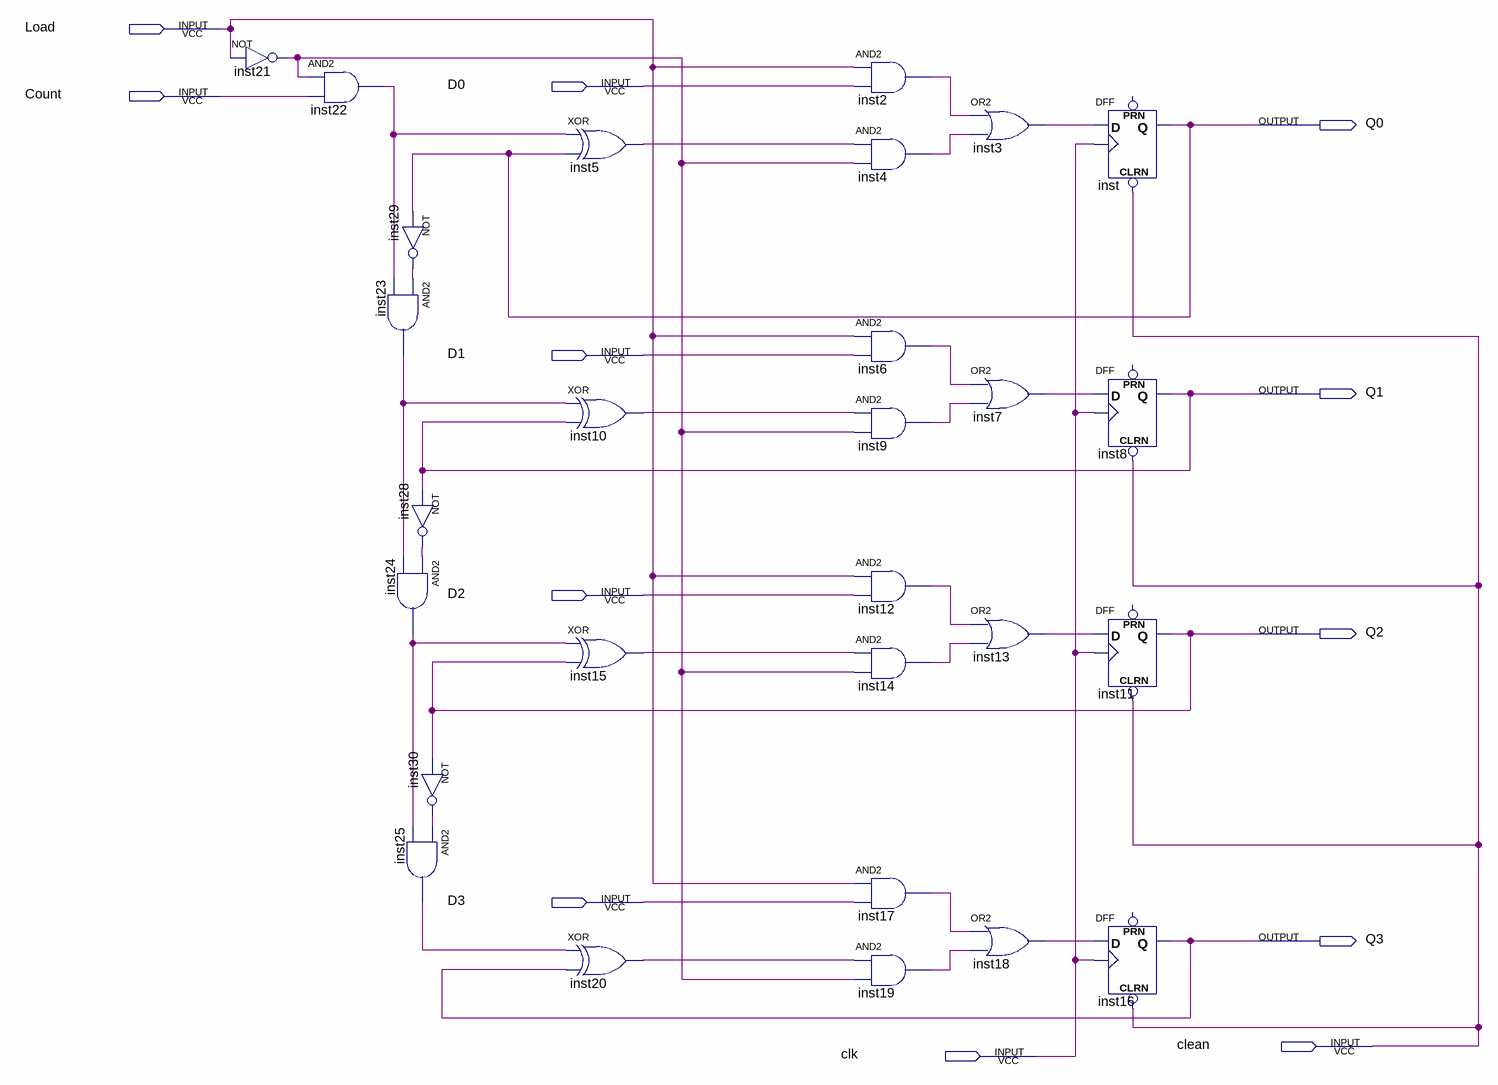
[diagram p0: schematic sheet]
// Quartus schematic counter.bdf as structural Verilog: 28 symbols, 12 pins
module counter (
  input  Load,
  input  D0,
  input  Count,
  input  D1,
  input  D2,
  input  D3,
  input  clean,
  input  clk,
  output Q0,
  output Q1,
  output Q2,
  output Q3
);

  wire inst2_out, inst3_out, inst4_out, inst5_out, inst6_out, inst7_out, inst9_out, inst10_out, inst12_out,
       inst13_out, inst14_out, inst15_out, inst17_out, inst18_out, inst19_out, inst20_out, inst21_out,
       inst22_out, inst23_out, inst24_out, inst25_out, inst28_out, inst29_out, inst30_out;

  not inst21 (inst21_out, Load);
  and inst22 (inst22_out, inst21_out, Count);
  not inst29 (inst29_out, Q0);
  and inst23 (inst23_out, inst29_out, inst22_out);
  not inst28 (inst28_out, Q1);
  and inst24 (inst24_out, inst28_out, inst23_out);
  not inst30 (inst30_out, Q2);
  and inst25 (inst25_out, inst30_out, inst24_out);
  xor inst5 (inst5_out, inst22_out, Q0);
  xor inst10 (inst10_out, inst23_out, Q1);
  xor inst15 (inst15_out, inst24_out, Q2);
  xor inst20 (inst20_out, inst25_out, Q3);
  and inst2 (inst2_out, Load, D0);
  and inst4 (inst4_out, inst5_out, inst21_out);
  and inst6 (inst6_out, Load, D1);
  and inst9 (inst9_out, inst10_out, inst21_out);
  and inst12 (inst12_out, Load, D2);
  and inst14 (inst14_out, inst15_out, inst21_out);
  and inst17 (inst17_out, Load, D3);
  and inst19 (inst19_out, inst20_out, inst21_out);
  or inst3 (inst3_out, inst2_out, inst4_out);
  or inst7 (inst7_out, inst6_out, inst9_out);
  or inst13 (inst13_out, inst12_out, inst14_out);
  or inst18 (inst18_out, inst17_out, inst19_out);
  DFF inst (.CLRN(clean), .CLK(clk), .D(inst3_out), .Q(Q0));  // open: PRN
  DFF inst8 (.CLRN(clean), .CLK(clk), .D(inst7_out), .Q(Q1));  // open: PRN
  DFF inst11 (.CLRN(clean), .CLK(clk), .D(inst13_out), .Q(Q2));  // open: PRN
  DFF inst16 (.CLRN(clean), .CLK(clk), .D(inst18_out), .Q(Q3));  // open: PRN
endmodule
